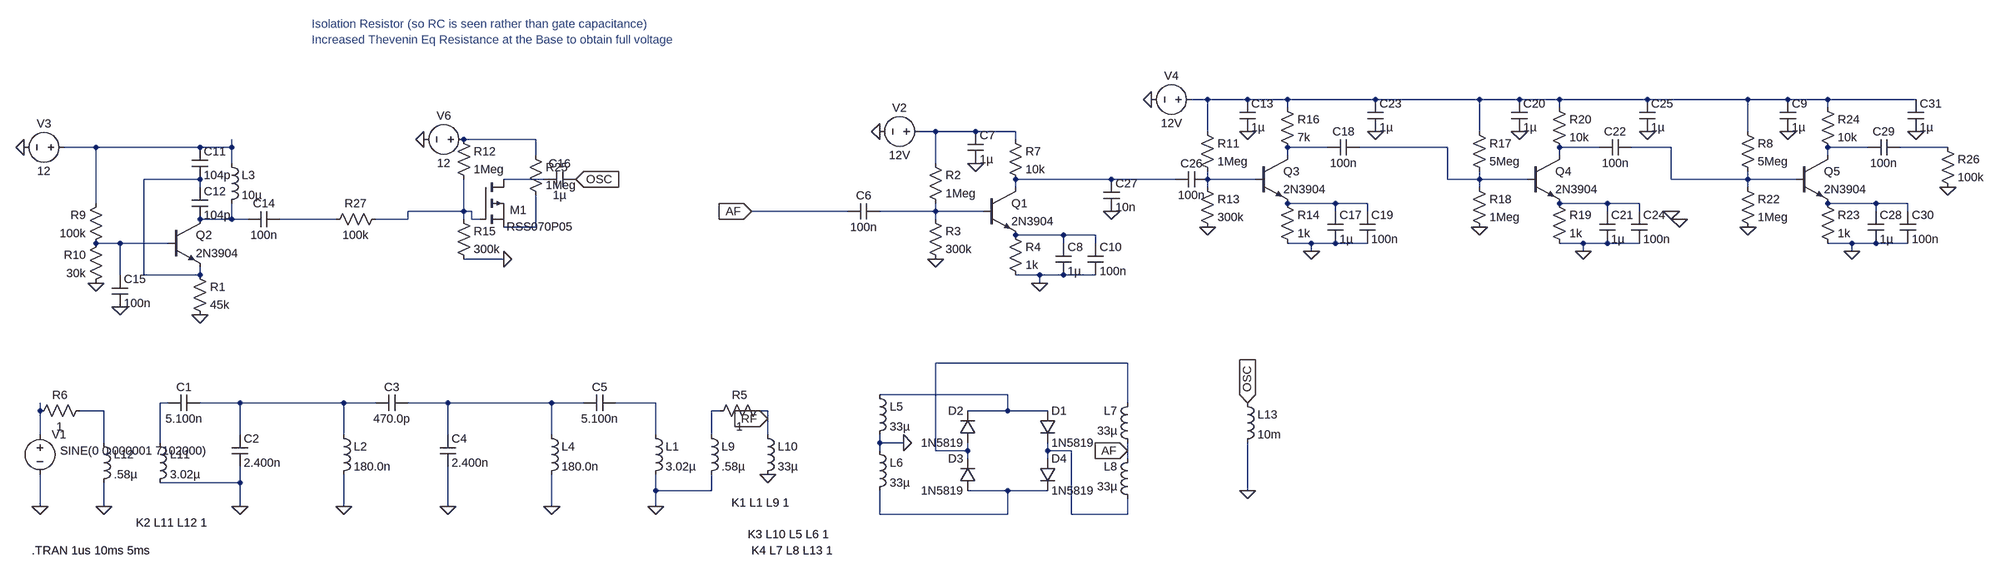
[diagram p0: schematic DCR.asc]
DCR.asc, the LTspice schematic file:
Version 4.1
SHEET 1 3712 1000
WIRE 2144 -608 2112 -608
WIRE 2224 -608 2144 -608
WIRE 2304 -608 2224 -608
WIRE 2480 -608 2304 -608
WIRE 2688 -608 2480 -608
WIRE 2768 -608 2688 -608
WIRE 2848 -608 2768 -608
WIRE 3024 -608 2848 -608
WIRE 3232 -608 3024 -608
WIRE 3312 -608 3232 -608
WIRE 3392 -608 3312 -608
WIRE 3568 -608 3392 -608
WIRE 2304 -592 2304 -608
WIRE 2848 -592 2848 -608
WIRE 3392 -592 3392 -608
WIRE 1600 -544 1568 -544
WIRE 1680 -544 1600 -544
WIRE 1760 -544 1680 -544
WIRE 2144 -544 2144 -608
WIRE 2688 -544 2688 -608
WIRE 3232 -544 3232 -608
WIRE 800 -528 656 -528
WIRE 1760 -528 1760 -544
WIRE -80 -512 -144 -512
WIRE 128 -512 -80 -512
WIRE 192 -512 192 -528
WIRE 192 -512 128 -512
WIRE 2384 -512 2304 -512
WIRE 2624 -512 2448 -512
WIRE 2928 -512 2848 -512
WIRE 3072 -512 2992 -512
WIRE 3472 -512 3392 -512
WIRE 3632 -512 3536 -512
WIRE 800 -496 800 -528
WIRE 2304 -496 2304 -512
WIRE 2848 -496 2848 -512
WIRE 3392 -496 3392 -512
WIRE 192 -480 192 -512
WIRE 1600 -480 1600 -544
WIRE 128 -448 16 -448
WIRE 816 -448 736 -448
WIRE 1952 -448 1760 -448
WIRE 2080 -448 1952 -448
WIRE 2144 -448 2144 -464
WIRE 2240 -448 2144 -448
WIRE 2624 -448 2624 -512
WIRE 2688 -448 2688 -464
WIRE 2688 -448 2624 -448
WIRE 2784 -448 2688 -448
WIRE 3072 -448 3072 -512
WIRE 3232 -448 3232 -464
WIRE 3232 -448 3072 -448
WIRE 3328 -448 3232 -448
WIRE 128 -432 128 -448
WIRE 1760 -432 1760 -448
WIRE 2144 -432 2144 -448
WIRE 2688 -432 2688 -448
WIRE 3232 -432 3232 -448
WIRE -80 -400 -80 -512
WIRE 2400 -400 2304 -400
WIRE 2464 -400 2400 -400
WIRE 2944 -400 2848 -400
WIRE 3008 -400 2944 -400
WIRE 3488 -400 3392 -400
WIRE 3552 -400 3488 -400
WIRE 656 -384 656 -448
WIRE 656 -384 544 -384
WIRE 672 -384 656 -384
WIRE 1424 -384 1232 -384
WIRE 1600 -384 1600 -400
WIRE 1600 -384 1488 -384
WIRE 1696 -384 1600 -384
WIRE 2400 -384 2400 -400
WIRE 2464 -384 2464 -400
WIRE 2944 -384 2944 -400
WIRE 3008 -384 3008 -400
WIRE 3488 -384 3488 -400
WIRE 3552 -384 3552 -400
WIRE 192 -368 192 -400
WIRE 192 -368 128 -368
WIRE 224 -368 192 -368
WIRE 400 -368 288 -368
WIRE 544 -368 544 -384
WIRE 544 -368 480 -368
WIRE 656 -368 656 -384
WIRE 672 -368 672 -384
WIRE 688 -368 672 -368
WIRE 1600 -368 1600 -384
WIRE 800 -352 800 -416
WIRE 800 -352 736 -352
WIRE 1856 -336 1760 -336
WIRE 1920 -336 1856 -336
WIRE -32 -320 -80 -320
WIRE 64 -320 -32 -320
WIRE 1856 -320 1856 -336
WIRE 1920 -320 1920 -336
WIRE 2352 -320 2304 -320
WIRE 2400 -320 2352 -320
WIRE 2464 -320 2400 -320
WIRE 2896 -320 2848 -320
WIRE 2944 -320 2896 -320
WIRE 3008 -320 2944 -320
WIRE 3440 -320 3392 -320
WIRE 3488 -320 3440 -320
WIRE 3552 -320 3488 -320
WIRE 2352 -304 2352 -320
WIRE 2896 -304 2896 -320
WIRE 3440 -304 3440 -320
WIRE 736 -288 656 -288
WIRE -32 -256 -32 -320
WIRE 16 -256 16 -448
WIRE 128 -256 128 -272
WIRE 128 -256 16 -256
WIRE 1808 -256 1760 -256
WIRE 1856 -256 1808 -256
WIRE 1920 -256 1856 -256
WIRE 1808 -240 1808 -256
WIRE 1984 -80 1600 -80
WIRE 1744 -16 1488 -16
WIRE 64 0 48 0
WIRE 208 0 128 0
WIRE 416 0 208 0
WIRE 480 0 416 0
WIRE 624 0 544 0
WIRE 832 0 624 0
WIRE 896 0 832 0
WIRE 1040 0 960 0
WIRE 1984 0 1984 -80
WIRE -192 16 -192 0
WIRE -64 16 -112 16
WIRE 1168 16 1152 16
WIRE 1264 16 1248 16
WIRE 1744 16 1744 -16
WIRE 1744 16 1664 16
WIRE 1824 16 1744 16
WIRE 1264 32 1264 16
WIRE -192 64 -192 16
WIRE 208 64 208 0
WIRE 416 64 416 0
WIRE 624 64 624 0
WIRE 832 64 832 0
WIRE 1040 64 1040 0
WIRE 1152 64 1152 16
WIRE 1264 64 1264 32
WIRE -64 80 -64 16
WIRE 48 80 48 0
WIRE 1488 80 1488 64
WIRE 1536 80 1488 80
WIRE 1488 96 1488 80
WIRE 1600 96 1600 -80
WIRE 1664 96 1664 80
WIRE 1664 96 1600 96
WIRE 1824 96 1824 80
WIRE 1872 96 1824 96
WIRE 1984 96 1984 80
WIRE 1664 112 1664 96
WIRE 1824 112 1824 96
WIRE 1984 112 1984 96
WIRE 208 160 208 128
WIRE 208 160 48 160
WIRE 1040 176 1040 144
WIRE 1152 176 1152 144
WIRE 1152 176 1040 176
WIRE 1744 176 1664 176
WIRE 1824 176 1744 176
WIRE 2224 176 2224 80
WIRE -192 208 -192 144
WIRE -64 208 -64 160
WIRE 208 208 208 160
WIRE 416 208 416 144
WIRE 624 208 624 128
WIRE 832 208 832 144
WIRE 1040 208 1040 176
WIRE 1488 224 1488 176
WIRE 1744 224 1744 176
WIRE 1744 224 1488 224
WIRE 1872 224 1872 96
WIRE 1984 224 1984 192
WIRE 1984 224 1872 224
FLAG 208 208 0
FLAG 416 208 0
FLAG 624 208 0
FLAG 832 208 0
FLAG 1040 208 0
FLAG -192 208 0
FLAG 1264 32 RF
IOPIN 1264 32 In
FLAG 1536 80 0
FLAG 1264 144 0
FLAG -64 208 0
FLAG 2224 176 0
FLAG 1984 96 AF
IOPIN 1984 96 In
FLAG 2224 0 OSC
IOPIN 2224 0 In
FLAG -80 -240 0
FLAG 128 -176 0
FLAG -224 -512 0
FLAG -32 -192 0
FLAG 576 -528 0
FLAG 736 -288 0
FLAG 880 -448 OSC
IOPIN 880 -448 In
FLAG 1488 -544 0
FLAG 1808 -240 0
FLAG 1600 -288 0
FLAG 1680 -480 0
FLAG 2032 -608 0
FLAG 2352 -304 0
FLAG 2144 -352 0
FLAG 2224 -544 0
FLAG 2480 -544 0
FLAG 2896 -304 0
FLAG 2688 -352 0
FLAG 2768 -544 0
FLAG 3024 -544 0
FLAG 1232 -384 AF
IOPIN 1232 -384 In
FLAG 1952 -384 0
FLAG 3440 -304 0
FLAG 3232 -352 0
FLAG 3312 -544 0
FLAG 3568 -544 0
FLAG 3632 -432 0
FLAG 3072 -384 0
FLAG 3088 -368 0
DATAFLAG 848 0 ""
DATAFLAG 848 0 ""
DATAFLAG 848 0 ""
DATAFLAG 848 0 ""
SYMBOL voltage -192 48 R0
WINDOW 123 40 48 Left 2
WINDOW 39 39 77 Left 2
SYMATTR Value2 SINE(0 0.000001 7102000)
SYMATTR InstName V1
SYMATTR Value ""
SYMBOL cap 64 16 R270
WINDOW 0 32 32 VTop 2
WINDOW 3 0 32 VBottom 2
SYMATTR InstName C1
SYMATTR Value 5.100n
SYMBOL cap 192 64 R0
SYMATTR InstName C2
SYMATTR Value 2.400n
SYMBOL ind 400 48 R0
SYMATTR InstName L2
SYMATTR Value 180.0n
SYMBOL cap 480 16 R270
WINDOW 0 32 32 VTop 2
WINDOW 3 0 32 VBottom 2
SYMATTR InstName C3
SYMATTR Value 470.0p
SYMBOL cap 608 64 R0
SYMATTR InstName C4
SYMATTR Value 2.400n
SYMBOL ind 816 48 R0
SYMATTR InstName L4
SYMATTR Value 180.0n
SYMBOL cap 896 16 R270
WINDOW 0 32 32 VTop 2
WINDOW 3 0 32 VBottom 2
SYMATTR InstName C5
SYMATTR Value 5.100n
SYMBOL ind 1024 48 R0
SYMATTR InstName L1
SYMATTR Value 3.02µ
SYMATTR Type ind
SYMATTR SpiceLine Rser=1m
SYMBOL diode 1680 80 R180
WINDOW 0 24 64 Left 2
WINDOW 3 24 0 Left 2
SYMATTR InstName D2
SYMATTR Value 1N5819
SYMBOL diode 1808 16 R0
SYMATTR InstName D1
SYMATTR Value 1N5819
SYMBOL diode 1680 176 R180
WINDOW 0 24 64 Left 2
WINDOW 3 24 0 Left 2
SYMATTR InstName D3
SYMATTR Value 1N5819
SYMBOL diode 1808 112 R0
SYMATTR InstName D4
SYMATTR Value 1N5819
SYMBOL ind 1472 -32 R0
SYMATTR InstName L5
SYMATTR Value 33µ
SYMATTR Type ind
SYMATTR SpiceLine Rser=1m
SYMBOL ind 1472 80 R0
SYMATTR InstName L6
SYMATTR Value 33µ
SYMATTR Type ind
SYMATTR SpiceLine Rser=1m
SYMBOL ind 2000 96 R180
WINDOW 0 36 80 Left 2
WINDOW 3 36 40 Left 2
SYMATTR InstName L7
SYMATTR Value 33µ
SYMATTR Type ind
SYMATTR SpiceLine Rser=10m
SYMBOL ind 2000 208 R180
WINDOW 0 36 80 Left 2
WINDOW 3 36 40 Left 2
SYMATTR InstName L8
SYMATTR Value 33µ
SYMATTR Type ind
SYMATTR SpiceLine Rser=10m
SYMBOL ind 1136 48 R0
SYMATTR InstName L9
SYMATTR Value .58µ
SYMATTR Type ind
SYMATTR SpiceLine Rser=1m
SYMBOL res 1264 0 R90
WINDOW 0 0 56 VBottom 2
WINDOW 3 32 56 VTop 2
SYMATTR InstName R5
SYMATTR Value 1
SYMBOL ind 1248 48 R0
SYMATTR InstName L10
SYMATTR Value 33µ
SYMATTR Type ind
SYMATTR SpiceLine Rser=1m
SYMBOL ind 32 64 R0
SYMATTR InstName L11
SYMATTR Value 3.02µ
SYMATTR Type ind
SYMATTR SpiceLine Rser=1m
SYMBOL ind -80 64 R0
SYMATTR InstName L12
SYMATTR Value .58µ
SYMATTR Type ind
SYMATTR SpiceLine Rser=1m
SYMBOL res -96 0 R90
WINDOW 0 0 56 VBottom 2
WINDOW 3 32 56 VTop 2
SYMATTR InstName R6
SYMATTR Value 1
SYMBOL ind 2208 -16 R0
SYMATTR InstName L13
SYMATTR Value 10m
SYMATTR Type ind
SYMATTR SpiceLine Rser=1m
SYMBOL npn 64 -368 R0
SYMATTR InstName Q2
SYMATTR Value 2N3904
SYMBOL res 112 -272 R0
SYMATTR InstName R1
SYMATTR Value 45k
SYMBOL cap 112 -512 R0
SYMATTR InstName C11
SYMATTR Value 104p
SYMBOL cap 112 -432 R0
SYMATTR InstName C12
SYMATTR Value 104p
SYMBOL res -64 -416 M0
SYMATTR InstName R9
SYMATTR Value 100k
SYMBOL res -64 -336 M0
SYMATTR InstName R10
SYMATTR Value 30k
SYMBOL voltage -128 -512 R90
WINDOW 0 -32 56 VBottom 2
WINDOW 3 32 56 VTop 2
WINDOW 123 0 0 Left 0
WINDOW 39 0 0 Left 0
SYMATTR InstName V3
SYMATTR Value 12
SYMBOL cap 288 -384 R90
WINDOW 0 0 32 VBottom 2
WINDOW 3 32 32 VTop 2
SYMATTR InstName C14
SYMATTR Value 100n
SYMBOL ind 176 -496 R0
SYMATTR InstName L3
SYMATTR Value 10µ
SYMATTR SpiceLine Rser=1m
SYMBOL cap -48 -256 R0
SYMATTR InstName C15
SYMATTR Value 100n
SYMBOL cap 880 -464 R90
WINDOW 0 0 32 VBottom 2
WINDOW 3 32 32 VTop 2
SYMATTR InstName C16
SYMATTR Value 1µ
SYMBOL pmos 688 -448 R0
WINDOW 0 60 62 Left 2
WINDOW 3 54 95 Left 2
SYMATTR InstName M1
SYMATTR Value RSS070P05
SYMBOL voltage 672 -528 R90
WINDOW 0 -32 56 VBottom 2
WINDOW 3 32 56 VTop 2
WINDOW 123 0 0 Left 0
WINDOW 39 0 0 Left 0
SYMATTR InstName V6
SYMATTR Value 12
SYMBOL res 640 -544 R0
SYMATTR InstName R12
SYMATTR Value 1Meg
SYMBOL res 640 -384 R0
SYMATTR InstName R15
SYMATTR Value 300k
SYMBOL res 784 -512 R0
SYMATTR InstName R25
SYMATTR Value 1Meg
SYMBOL res 496 -384 R90
WINDOW 0 0 56 VBottom 2
WINDOW 3 32 56 VTop 2
SYMATTR InstName R27
SYMATTR Value 100k
SYMBOL voltage 1584 -544 R90
WINDOW 0 -32 56 VBottom 2
WINDOW 3 32 56 VTop 2
SYMATTR InstName V2
SYMATTR Value 12V
SYMBOL res 1584 -496 R0
SYMATTR InstName R2
SYMATTR Value 1Meg
SYMBOL res 1584 -384 R0
SYMATTR InstName R3
SYMATTR Value 300k
SYMBOL npn 1696 -432 R0
SYMATTR InstName Q1
SYMATTR Value 2N3904
SYMBOL res 1744 -352 R0
SYMATTR InstName R4
SYMATTR Value 1k
SYMBOL cap 1488 -400 R90
WINDOW 0 0 32 VBottom 2
WINDOW 3 32 32 VTop 2
SYMATTR InstName C6
SYMATTR Value 100n
SYMBOL res 1744 -544 R0
SYMATTR InstName R7
SYMATTR Value 10k
SYMBOL cap 1664 -544 R0
SYMATTR InstName C7
SYMATTR Value 1µ
SYMBOL cap 1840 -320 R0
SYMATTR InstName C8
SYMATTR Value 1µ
SYMBOL cap 1904 -320 R0
SYMATTR InstName C10
SYMATTR Value 100n
SYMBOL voltage 2128 -608 R90
WINDOW 0 -32 56 VBottom 2
WINDOW 3 32 56 VTop 2
SYMATTR InstName V4
SYMATTR Value 12V
SYMBOL res 2128 -560 R0
SYMATTR InstName R11
SYMATTR Value 1Meg
SYMBOL res 2128 -448 R0
SYMATTR InstName R13
SYMATTR Value 300k
SYMBOL npn 2240 -496 R0
SYMATTR InstName Q3
SYMATTR Value 2N3904
SYMBOL res 2288 -416 R0
SYMATTR InstName R14
SYMATTR Value 1k
SYMBOL res 2288 -608 R0
SYMATTR InstName R16
SYMATTR Value 7k
SYMBOL cap 2208 -608 R0
SYMATTR InstName C13
SYMATTR Value 1µ
SYMBOL cap 2384 -384 R0
SYMATTR InstName C17
SYMATTR Value 1µ
SYMBOL cap 2448 -528 R90
WINDOW 0 0 32 VBottom 2
WINDOW 3 32 32 VTop 2
SYMATTR InstName C18
SYMATTR Value 100n
SYMBOL cap 2448 -384 R0
SYMATTR InstName C19
SYMATTR Value 100n
SYMBOL cap 2464 -608 R0
SYMATTR InstName C23
SYMATTR Value 1µ
SYMBOL res 2672 -560 R0
SYMATTR InstName R17
SYMATTR Value 5Meg
SYMBOL res 2672 -448 R0
SYMATTR InstName R18
SYMATTR Value 1Meg
SYMBOL npn 2784 -496 R0
SYMATTR InstName Q4
SYMATTR Value 2N3904
SYMBOL res 2832 -416 R0
SYMATTR InstName R19
SYMATTR Value 1k
SYMBOL res 2832 -608 R0
SYMATTR InstName R20
SYMATTR Value 10k
SYMBOL cap 2752 -608 R0
SYMATTR InstName C20
SYMATTR Value 1µ
SYMBOL cap 2928 -384 R0
SYMATTR InstName C21
SYMATTR Value 1µ
SYMBOL cap 2992 -528 R90
WINDOW 0 0 32 VBottom 2
WINDOW 3 32 32 VTop 2
SYMATTR InstName C22
SYMATTR Value 100n
SYMBOL cap 2992 -384 R0
SYMATTR InstName C24
SYMATTR Value 100n
SYMBOL cap 3008 -608 R0
SYMATTR InstName C25
SYMATTR Value 1µ
SYMBOL cap 2144 -464 R90
WINDOW 0 0 32 VBottom 2
WINDOW 3 32 32 VTop 2
SYMATTR InstName C26
SYMATTR Value 100n
SYMBOL cap 1936 -448 R0
SYMATTR InstName C27
SYMATTR Value 10n
SYMBOL res 3216 -560 R0
SYMATTR InstName R8
SYMATTR Value 5Meg
SYMBOL res 3216 -448 R0
SYMATTR InstName R22
SYMATTR Value 1Meg
SYMBOL npn 3328 -496 R0
SYMATTR InstName Q5
SYMATTR Value 2N3904
SYMBOL res 3376 -416 R0
SYMATTR InstName R23
SYMATTR Value 1k
SYMBOL res 3376 -608 R0
SYMATTR InstName R24
SYMATTR Value 10k
SYMBOL cap 3296 -608 R0
SYMATTR InstName C9
SYMATTR Value 1µ
SYMBOL cap 3472 -384 R0
SYMATTR InstName C28
SYMATTR Value 1µ
SYMBOL cap 3536 -528 R90
WINDOW 0 0 32 VBottom 2
WINDOW 3 32 32 VTop 2
SYMATTR InstName C29
SYMATTR Value 100n
SYMBOL cap 3536 -384 R0
SYMATTR InstName C30
SYMATTR Value 100n
SYMBOL cap 3552 -608 R0
SYMATTR InstName C31
SYMATTR Value 1µ
SYMBOL res 3616 -528 R0
SYMATTR InstName R26
SYMATTR Value 100k
TEXT -208 296 Left 2 !.TRAN 1us 10ms 5ms
TEXT 1192 200 Left 2 !K1 L1 L9 1
TEXT 0 240 Left 2 !K2 L11 L12 1
TEXT 1224 264 Left 2 !K3 L10 L5 L6 1
TEXT 1232 296 Left 2 !K4 L7 L8 L13 1
TEXT 352 -760 Left 2 ;Isolation Resistor (so RC is seen rather than gate capacitance)
TEXT 352 -728 Left 2 ;Increased Thevenin Eq Resistance at the Base to obtain full voltage

The netlist it stands for:
* DCR.asc
V1 N031 0 SINE(0 0.000001 7102000)
C1 N027 N028 5.100n
C2 N028 0 2.400n
L2 N028 0 180.0n
C3 N028 N029 470.0p
C4 N029 0 2.400n
L4 N029 0 180.0n
C5 N029 N030 5.100n
L1 N030 0 3.02µ Rser=1m
D2 N025 N026 1N5819
D1 N026 N034 1N5819
D3 N035 N025 1N5819
D4 N034 N035 1N5819
L5 N026 0 33µ Rser=1m
L6 0 N035 33µ Rser=1m
L7 AF N025 33µ Rser=10m
L8 N034 AF 33µ Rser=10m
L9 N033 0 .58µ Rser=1m
R5 RF N033 1
L10 RF 0 33µ Rser=1m
L11 N027 0 3.02µ Rser=1m
L12 N032 0 .58µ Rser=1m
R6 N032 N031 1
L13 OSC 0 10m Rser=1m
Q2 N020 N024 N011 0 2N3904
R1 N011 0 45k
C11 N004 N011 104p
C12 N011 N020 104p
R9 N004 N024 100k
R10 N024 0 30k
V3 N004 0 12
C14 N021 N020 100n
L3 N004 N020 10µ Rser=1m
C15 N024 0 100n
C16 OSC N012 1µ
M1 N012 N018 N022 N022 RSS070P05
V6 N003 0 12
R12 N003 N018 1Meg
R15 N018 0 300k
R25 N003 N022 1Meg
R27 N018 N021 100k
V2 N002 0 12V
R2 N002 N019 1Meg
R3 N019 0 300k
Q1 N013 N019 N023 0 2N3904
R4 N023 0 1k
C6 N019 AF 100n
R7 N002 N013 10k
C7 N002 0 1µ
C8 N023 0 1µ
C10 N023 0 100n
V4 N001 0 12V
R11 N001 N014 1Meg
R13 N014 0 300k
Q3 N005 N014 N015 0 2N3904
R14 N015 0 1k
R16 N001 N005 7k
C13 N001 0 1µ
C17 N015 0 1µ
C18 N006 N005 100n
C19 N015 0 100n
C23 N001 0 1µ
R17 N001 N006 5Meg
R18 N006 0 1Meg
Q4 N007 N006 N016 0 2N3904
R19 N016 0 1k
R20 N001 N007 10k
C20 N001 0 1µ
C21 N016 0 1µ
C22 N008 N007 100n
C24 N016 0 100n
C25 N001 0 1µ
C26 N014 N013 100n
C27 N013 0 10n
R8 N001 N008 5Meg
R22 N008 0 1Meg
Q5 N009 N008 N017 0 2N3904
R23 N017 0 1k
R24 N001 N009 10k
C9 N001 0 1µ
C28 N017 0 1µ
C29 N010 N009 100n
C30 N017 0 100n
C31 N001 0 1µ
R26 N010 0 100k
.model D D
.lib standard.dio
.model NPN NPN
.model PNP PNP
.lib standard.bjt
.model NMOS NMOS
.model PMOS PMOS
.lib standard.mos
.TRAN 1us 10ms 5ms
K1 L1 L9 1
K2 L11 L12 1
K3 L10 L5 L6 1
K4 L7 L8 L13 1
* Isolation Resistor (so RC is seen rather than gate capacitance)
* Increased Thevenin Eq Resistance at the Base to obtain full voltage
.backanno
.end